# EAGLE design csp_v2.1 (EAGLE 7.6.0)
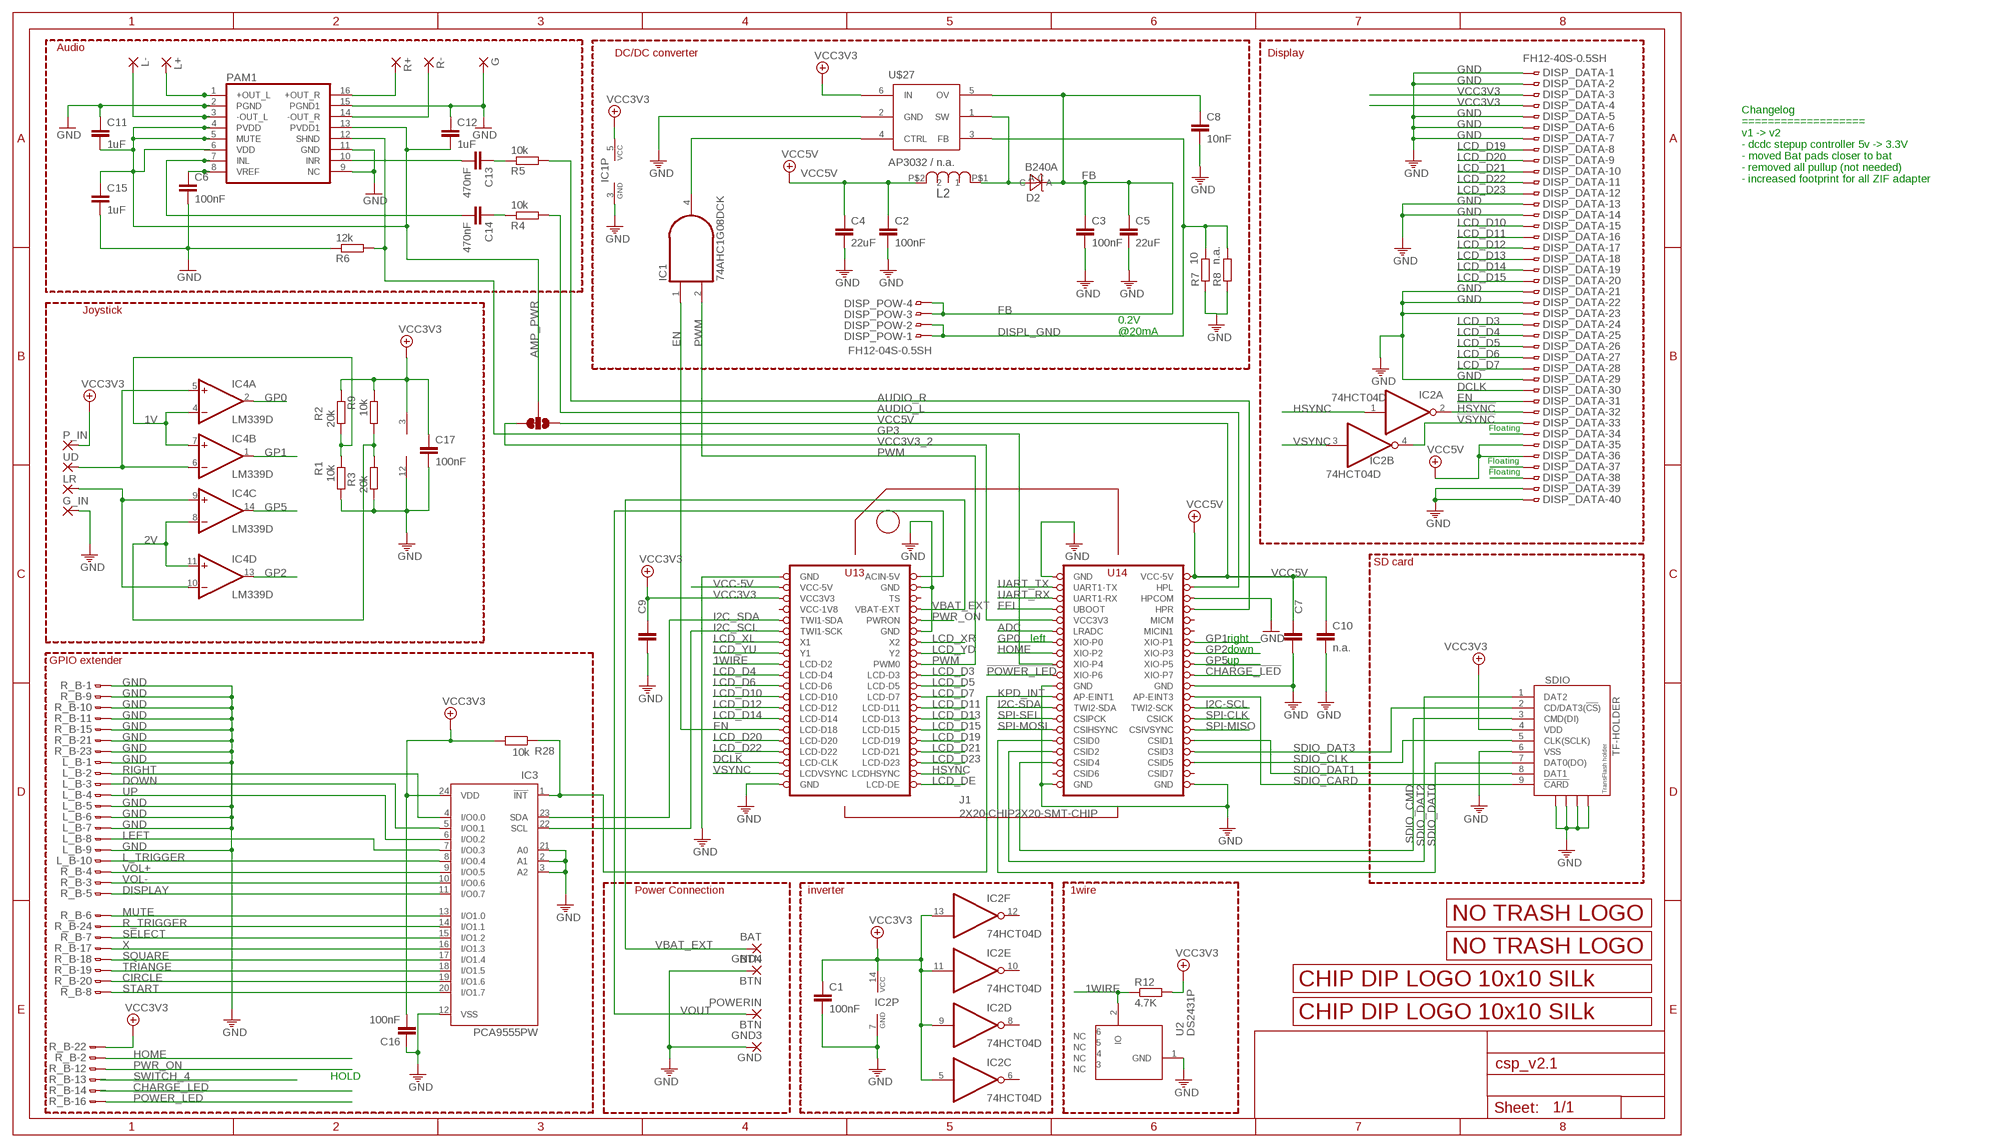
[diagram p0: schematic, sheet 1]

## Parts
BAT  BTN  SMD2  [SMD1,27-2,54]
C1  100nF  C-EUC0805  [C0805]
C2  100nF  C-EUC0805  [C0805]
C3  100nF  C-EUC0805  [C0805]
C4  22uF  C-EUC1206  [C1206]
C5  22uF  C-EUC1206  [C1206]
C6  100nF  C-EUC0805  [C0805]
C7  n.a.  C-EUC0805  [C0805]
C8  10nF  C-EUC0805  [C0805]
C9  n.a.  C-EUC0805  [C0805]
C10  n.a.  C-EUC0805  [C0805]
C11  1uF  C-EUC0805  [C0805]
C12  1uF  C-EUC0805  [C0805]
C13  470nF  C-EUC0805  [C0805]
C14  470nF  C-EUC0805  [C0805]
C15  1uF  C-EUC0805  [C0805]
C16  100nF  C-EUC0805  [C0805]
C17  100nF  C-EUC0805  [C0805]
D2  B240A  DIODE_SCHTKY_B240  [DO-214AC]
DISP_DATA  FH12-40S-0.5SH  [FH12-40S-0.5SH]
DISP_POW  FH12-04S-0.5SH  [FH12-04S-0.5SH]
G  1,6/0,8  [1,6/0,8]
G_IN  BTN  SMD1.36X3  [SMD1,36-3]
GND3  GND  SMD2  [SMD1,27-2,54]
GND4  BTN  SMD2  [SMD1,27-2,54]
IC1  74AHC1G08DCK  [SC70-5]
IC2  74HCT04D  [SO14]
IC3  PCA9555PW  [TSSOP24]
IC4  LM339D  [SO14]
J1  2X20-CHIP2X20-SMT-CHIP  [2XAWHW40_G_SMD_R]
L2  SRN6045-100M  [SRN6045]
L+  1,6/0,8  [1,6/0,8]
L-  1,6/0,8  [1,6/0,8]
L_B  FH12-10S-0.5SH  [FH12-10S-0.5SH]
LR  BTN  SMD1.36X3  [SMD1,36-3]
P_IN  BTN  SMD1.36X3  [SMD1,36-3]
PAM1  PAM8403  [SOP-16]
POWERIN  BTN  SMD2  [SMD1,27-2,54]
R1  10k  R-EU_M0805  [M0805]
R2  20k  R-EU_M0805  [M0805]
R3  20k  R-EU_M0805  [M0805]
R4  10k  R-EU_R0805  [R0805]
R5  10k  R-EU_R0805  [R0805]
R6  12k  R-EU_R0805  [R0805]
R7  10  R-EU_M0805  [M0805]
R8  n.a.  R-EU_M0805  [M0805]
R9  10k  R-EU_M0805  [M0805]
R12  4.7K  R-EU_M0805  [M0805]
R28  10k  R-EU_M0805  [M0805]
R+  1,6/0,8  [1,6/0,8]
R-  1,6/0,8  [1,6/0,8]
R_B  FH12-24S-0.5SH  [FH12-24S-0.5SH]
SDIO  TF-HOLDER  [TF-PULL]
SJ3  SMD_SJ_3WAY_CLOSED  [SMD_SJ_3WAY_CLOSED]
U2  DS2431P  [TSOC6]
U$2  LOGO_10X10_SILK  [LOGO2_10X10_SILK]
U$3  LOGO_NO_TRASHROHS  [LOGO_ROHS_SYM]
U$4  LOGO_NO_TRASHNO_TRASH  [LOGO_ROHS_NO_TRASH]
U$5  LOGO_10X10_SILK  [LOGO2_10X10_SILK]
U$27  AP3032 / n.a.  AP3032  [SOT23-6]
UD  BTN  SMD1.36X3  [SMD1,36-3]

## Nets
1V: IC4.4(A:-IN) IC4.7(B:+IN) R1.1 R2.2
1WIRE: J1.LCD-D2 R12.1 U2.2(IO)
2V: IC4.8(C:-IN) IC4.11(D:+IN) R3.1 R9.2
!CHARGE_LED: J1.XIO-P7 R_B.14
!HSYNC: DISP_DATA.32 IC2.2(A:O)
!POWER_LED: J1.XIO-P6 R_B.16
!VSYNC: DISP_DATA.33 IC2.4(B:O)
ADC: J1.LRADC
AMP_PWR: C11.2 C12.2 C15.1 PAM1.4(PVDD) PAM1.5(MUTE) PAM1.6(VDD) PAM1.13(PVDD1) SJ3.2
AUDIO_L: J1.HPL R4.2
AUDIO_R: J1.HPR R5.2
CIRCLE: IC3.19(I/O1.6) R_B.20
DCLK: DISP_DATA.30 J1.LCD-CLK
DISPL_GND: DISP_POW.1 DISP_POW.2 R7.2 R8.2 U$27.3(FB)
DISPLAY: IC3.11(I/O0.7) R_B.5
DOWN: IC3.5(I/O0.1) L_B.3
EN: DISP_DATA.31 IC1.1(I0) J1.LCD-D18
FB: C3.1 C5.1 C8.1 D2.C DISP_POW.3 DISP_POW.4 U$27.5(OV)
FEL: J1.FEL(UBOOT)
GND: C1.2 C2.2 C3.2 C4.2 C5.2 C6.2 C7.2 C8.2 C9.2 C10.2 C11.1 C12.1 C15.2 C16.1 C17.2 DISP_DATA.1 DISP_DATA.2 DISP_DATA.5 DISP_DATA.6 DISP_DATA.7 DISP_DATA.13 DISP_DATA.14 DISP_DATA.21 DISP_DATA.22 DISP_DATA.23 DISP_DATA.29 DISP_DATA.39 DISP_DATA.40 G.1(P) G_IN.P$1(P) GND3.1(P) GND4.1(P) IC1.3(GND) IC2.7(P:GND) IC3.2(A1) IC3.3(A2) IC3.12(VSS) IC3.21(A0) IC4.12(P:GND) J1.GND@1(GND) J1.GND@2(GND) J1.GND@3(GND) J1.GND@4(GND) J1.GND@5(GND) J1.GND@6(GND) J1.GND@7(GND) J1.GND@8(GND) J1.GND@10(GND) J1.HPCOM L_B.1 L_B.5 L_B.6 L_B.7 L_B.9 PAM1.2(PGND) PAM1.9(NC) PAM1.11(GND) PAM1.15(PGND1) R1.2 R3.2 R6.1 R7.1 R8.1 R_B.1 R_B.9 R_B.10 R_B.11 R_B.15 R_B.21 R_B.23 SDIO.6(VSS) SDIO.S1 SDIO.S2 SDIO.S3 SDIO.S4 U2.1(GND) U$27.2(GND)
GP0: IC4.2(A:OUT) J1.XIO-P0
GP1: IC4.1(B:OUT) J1.XIO-P1
GP2: IC4.13(D:OUT) J1.XIO-P3
GP3: J1.XIO-P4 PAM1.12(SHND) R6.2
GP5: IC4.14(C:OUT) J1.XIO-P5
HOME: J1.XIO-P2 R_B.2
HSYNC: IC2.1(A:I) J1.LCD-HSYNC(LCDHSYNC)
I2C-SCL: J1.TWI2-SCK
I2C-SDA: J1.TWI2-SDA
I2C_SCL: IC3.22(SCL) J1.TWI1-SCK
I2C_SDA: IC3.23(SDA) J1.TWI1-SDA
INL: C14.2 PAM1.7(INL)
INR: C13.2 PAM1.10(INR)
KPD_INT: IC3.1(!INT) J1.AP-EINT1 R28.1
L+OUT: L+.1(P) PAM1.1(+OUT_L)
L-OUT: L-.1(P) PAM1.3(-OUT_L)
L_TRIGGER: IC3.8(I/O0.4) L_B.10
LCD_D3: DISP_DATA.24 J1.LCD-D3
LCD_D4: DISP_DATA.25 J1.LCD-D4
LCD_D5: DISP_DATA.26 J1.LCD-D5
LCD_D6: DISP_DATA.27 J1.LCD-D6
LCD_D7: DISP_DATA.28 J1.LCD-D7
LCD_D10: DISP_DATA.15 J1.LCD-D10
LCD_D11: DISP_DATA.16 J1.LCD-D11
LCD_D12: DISP_DATA.17 J1.LCD-D12
LCD_D13: DISP_DATA.18 J1.LCD-D13
LCD_D14: DISP_DATA.19 J1.LCD-D14
LCD_D15: DISP_DATA.20 J1.LCD-D15
LCD_D19: DISP_DATA.8 J1.LCD-D19
LCD_D20: DISP_DATA.9 J1.LCD-D20
LCD_D21: DISP_DATA.10 J1.LCD-D21
LCD_D22: DISP_DATA.11 J1.LCD-D22
LCD_D23: DISP_DATA.12 J1.LCD-D23
LCD_DE: J1.LCD-DE
LCD_XL: J1.X1
LCD_XR: J1.X2
LCD_YD: J1.Y2
LCD_YU: J1.Y1
LEFT: IC3.7(I/O0.3) L_B.8
MUTE: IC3.13(I/O1.0) R_B.6
N$1: IC1.4(O) U$27.4(CTRL)
N$9: DISP_DATA.38
N$24: DISP_DATA.37
N$25: DISP_DATA.34
N$30: IC4.5(A:+IN) IC4.6(B:-IN) UD.P$1(P)
N$31: IC4.9(C:+IN) IC4.10(D:-IN) LR.P$1(P)
N$38: C6.1 PAM1.8(VREF)
N$41: C14.1 R4.1
N$43: C13.1 R5.1
PWM: IC1.2(I1) J1.PWM0
PWR_ON: J1.PWRON R_B.12
R+OUT: PAM1.16(+OUT_R) R+.1(P)
R-OUT: PAM1.14(-OUT_R) R-.1(P)
R_TRIGGER: IC3.14(I/O1.1) R_B.24
RIGHT: IC3.4(I/O0.0) L_B.2
SDIO_CARD: J1.AP-EINT3 SDIO.9(!CARD)
SDIO_CLK: J1.CSID5 SDIO.5(CLK(SCLK))
SDIO_CMD: J1.CISD4(CSID4) SDIO.3(CMD(DI))
SDIO_DAT0: J1.CSID0 SDIO.7(DAT0(DO))
SDIO_DAT1: J1.CSID1 SDIO.8(DAT1)
SDIO_DAT2: J1.CSID2 SDIO.1(DAT2)
SDIO_DAT3: J1.CSID3 SDIO.2(CD/DAT3(!CS!))
SELECT: IC3.15(I/O1.2) R_B.7
SPI-CLK: J1.CSICK
SPI-MISO: J1.CSIVSYNC
SPI-MOSI: J1.CSIHYSYNC(CSIHSYNC)
SPI-SEL: J1.CSPICK(CSIPCK)
SQUARE: IC3.17(I/O1.4) R_B.18
START: IC3.20(I/O1.7) R_B.8
SWITCH_4: R_B.13
TRIANGE: IC3.18(I/O1.5) R_B.19
UART_RX: J1.UART1-RX
UART_TX: J1.UART1-TX
UP: IC3.6(I/O0.2) L_B.4
VBAT_EXT: BAT.1(P) J1.BAT(VBAT-EXT)
VCC3V3: C1.1 C9.1 C16.2 C17.1 DISP_DATA.3 DISP_DATA.4 IC1.5(VCC) IC2.5(C:I) IC2.9(D:I) IC2.11(E:I) IC2.13(F:I) IC2.14(P:VCC) IC3.24(VDD) IC4.3(P:V+) J1.VCC3V3@2(VCC3V3) P_IN.P$1(P) R2.1 R9.1 R12.2 R28.2 R_B.22 SDIO.4(VDD) U$27.6(IN)
VCC3V3_2: J1.VCC3V3@1(VCC3V3) SJ3.1
VCC5V: C2.1 C4.1 C7.1 C10.1 DISP_DATA.35 DISP_DATA.36 J1.VCC-5V@2(VCC-5V) L2.P$2 SJ3.3
VCC-5V: J1.VCC-5V@1(VCC-5V)
VOL+: IC3.9(I/O0.5) R_B.4
VOL-: IC3.10(I/O0.6) R_B.3
VOUT: J1.CHG-IN(ACIN-5V) POWERIN.1(P)
VREG_OUTPUT: D2.A L2.P$1 U$27.1(SW)
VSYNC: IC2.3(B:I) J1.LCD-VSYNC(LCDVSYNC)
X: IC3.16(I/O1.3) R_B.17
Unconnected: IC2.6(C:O) IC2.8(D:O) IC2.10(E:O) IC2.12(F:O) J1.CSID6 J1.CSID7 J1.MICIN1 J1.MICM J1.TS U2.3(NC) U2.4(NC) U2.5(NC) U2.6(NC)

## Notes on the sheet
- Audio
- DC/DC converter | Display
- Changelog
  ===================
  v1 -> v2
  - dcdc stepup controller 5v -> 3.3V
  - moved Bat pads closer to bat
  - removed all pullup (not needed)
  - increased footprint for all ZIF adapter
- Joystick
- 0.2V
  @20mA
- Floating
- Floating
- Floating
- SD card
- left | right
- down
- GPIO extender | up
- Power Connection | inverter | 1wire
- HOLD

## Power pins joined to a net without a drawn wire
VCC-1V8: J1.VCC1V8(VCC-1V8)

## Library data of the parts
BAT GND3 GND4 POWERIN = wirepad:SMD2: SMD PAD
C1-C17 = rcl:C-EU: CAPACITOR, European symbol
D2 = Keyboard v0_5:DIODE_SCHTKY_B240; DESCRIPTION: DIODE SMD General Purpose 400V 1A 1.4W RoHS DO-214AC; FOOTPRINT: DO-214AC; LINK: http://www.digikey.com/product-detail/en/B240A-13-F/B240A-FDICT-ND/717810; MFG: DIGIKEY; MFG_PN: B240A-FDICT-ND; PART_TYPE: DIODE; PRICE: 0.11; VENDOR: DIODES; VENDOR_PART_NUMBER: B240A-13-F
DISP_DATA = JKW_CHIP:FH12-40S-0.5S: 0.5mm Pitch Connectors For FPC/FFC Source: Data sheet <http://www.hirose.co.jp/cataloge_hp/e58605370.pdf>; MPN: FH12-40S-0.5SH(55); OC_FARNELL: 1324556; OC_NEWARK: 34M6178
DISP_POW = JKW_CHIP:FH12-04S-0.5S: 0.5mm Pitch Connectors For FPC/FFC Source: Data sheet <http://www.hirose.co.jp/cataloge_hp/e58605370.pdf>; MPN: FH12-10S-0.5SH(55); OC_FARNELL: 1324540; OC_NEWARK: 34M6152
G L+ L- R+ R- = wirepad:1,6/0,8: THROUGH-HOLE PAD
G_IN LR P_IN UD = JKW_CHIP:SMD1.36X3: SMD PAD
IC1 = 74xx-little-us:74*1G08: 2-input AND gate
IC2 = JKW_CHIP:74*04: Hex INVERTER
IC3 = micro-philips:PCA9555: 16-bit I2C and SMBus I/O port with interrupt Source: PCA9555_5.pdf; MPN: PCA9555PW; OC_FARNELL: 1408297; OC_NEWARK: 63K6069
IC4 = linear:LM339: Low Power Low Offset Voltage Quad Comparators with open collector; LM139/LM239/LM339/LM2901/LM3302
J1 = JKW_CHIP:2X20-CHIP: Chip header
L2 = Keyboard v0_5:SRN6045-100M; DESCRIPTION: power inductor 10uH 2.5A 58.6 mohm; FOOTPRINT: SRN6045; LINK: http://www.digikey.com/product-detail/en/SRN6045-100M/SRN6045-100MTR-ND/2756120; MFG: DIGIKEY; MFG_PN: SRN6045-100MTR-ND; PART_TYPE: IND; PRICE: 0.15; TOLLERANCE: ±20%; VENDOR: BOURNS; VENDOR_PART_NUMBER: SRN6045-100M
L_B = JKW_CHIP:FH12-10S-0.5S: 0.5mm Pitch Connectors For FPC/FFC Source: Data sheet <http://www.hirose.co.jp/cataloge_hp/e58605370.pdf>; MPN: FH12-10S-0.5SH(55); OC_FARNELL: 1324540; OC_NEWARK: 34M6152
PAM1 = JKW_CHIP:PAM8403: Dual channel audio amplifier IC - PAM8403
R1-R9 R12 R28 = rcl:R-EU_: RESISTOR, European symbol
R_B = JKW_CHIP:FH12-24S-0.5S: 0.5mm Pitch Connectors For FPC/FFC Source: Data sheet <http://www.hirose.co.jp/cataloge_hp/e58605370.pdf>; MPN: FH12-24S-0.5SH(55); OC_FARNELL: 1324552; OC_NEWARK: 34M6170
SDIO = JKW_CHIP:TF-HOLDER: TF / Micro SD socket is PUSH-PUSH type, the card can be pushed into and auto locked and pushed out by simply press the card. Surface Mounting type.
SJ3 = JKW_CHIP:SMD_SJ_3WAY_CLOSED
U2 = JKW_CHIP:DS2431: 1024-Bit EEPROM This chip provides a 4x256 Bit EEPROM, which can be programmed@5V. Write protection and OTP emulation are available, too. Author: Jan Kandziora <jjj@gmx.de>; DESCRIPTION: IC, 1024-Bit, 1-Wire EEPROM, TSOC6; FOOTPRINT: TSOC6; LINK: http://www.digikey.com/product-detail/en/DS2431P%2BT%26R/DS2431P%2BT%26RCT-ND/3647900; MFG: DIGIKEY; MFG_PN: DS2431P+T&RCT-ND; PART_TYPE: IC; PRICE: 0.98; VENDOR: MAXIM; VENDOR_PART_NUMBER: DS2431P+T&R
U$2 U$5 = JKW_CHIP:LOGO_10X10_SILK
U$3 U$4 = JKW_CHIP:LOGO_NO_TRASH
U$27 = JKW_CHIP:AP3032

## Board
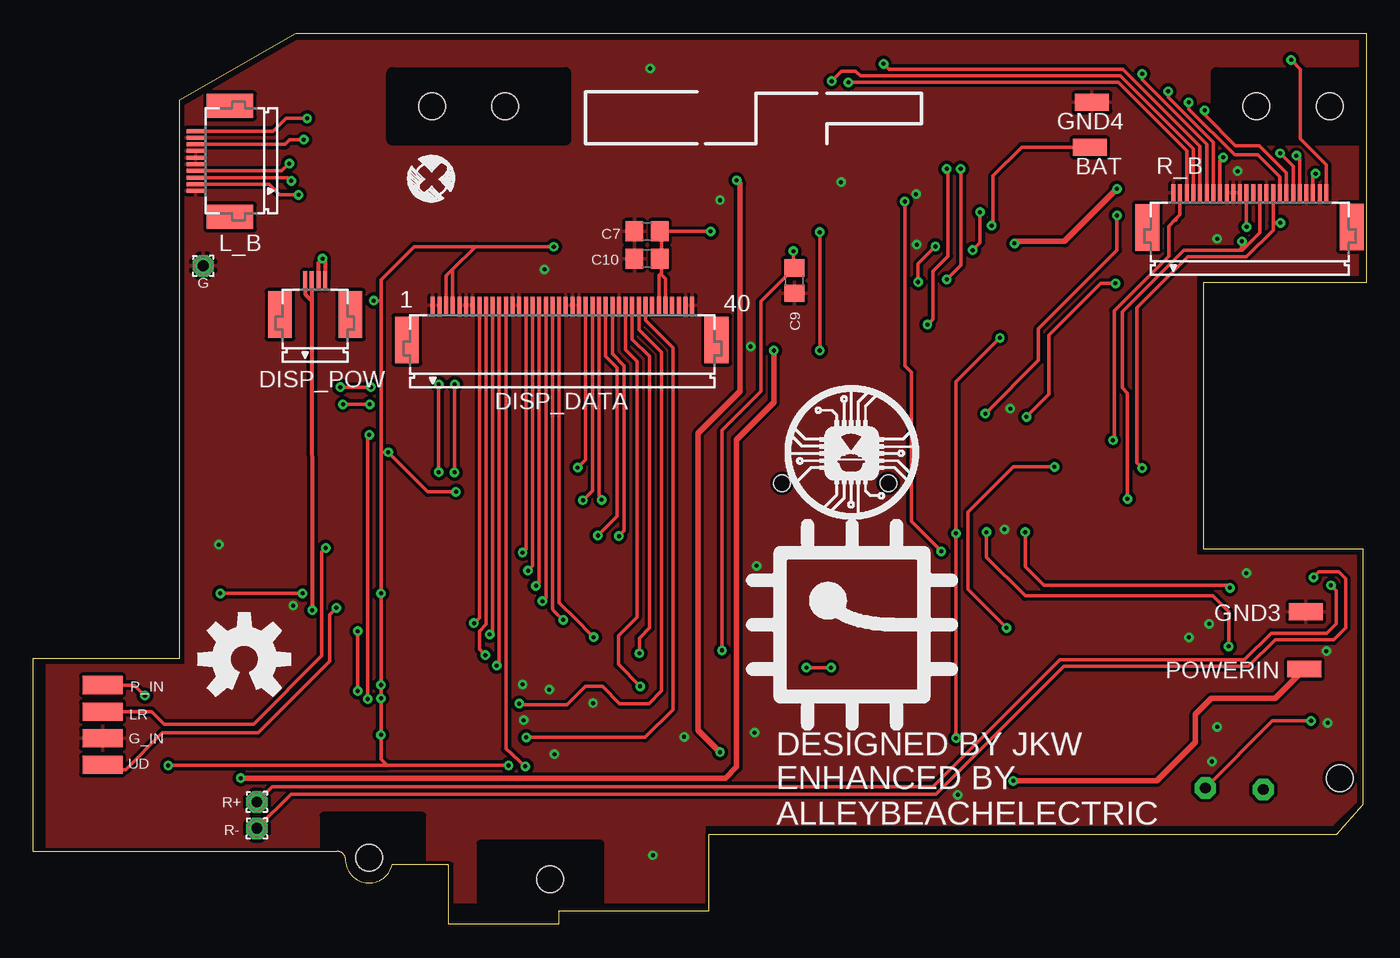
[diagram p1: board, top side]
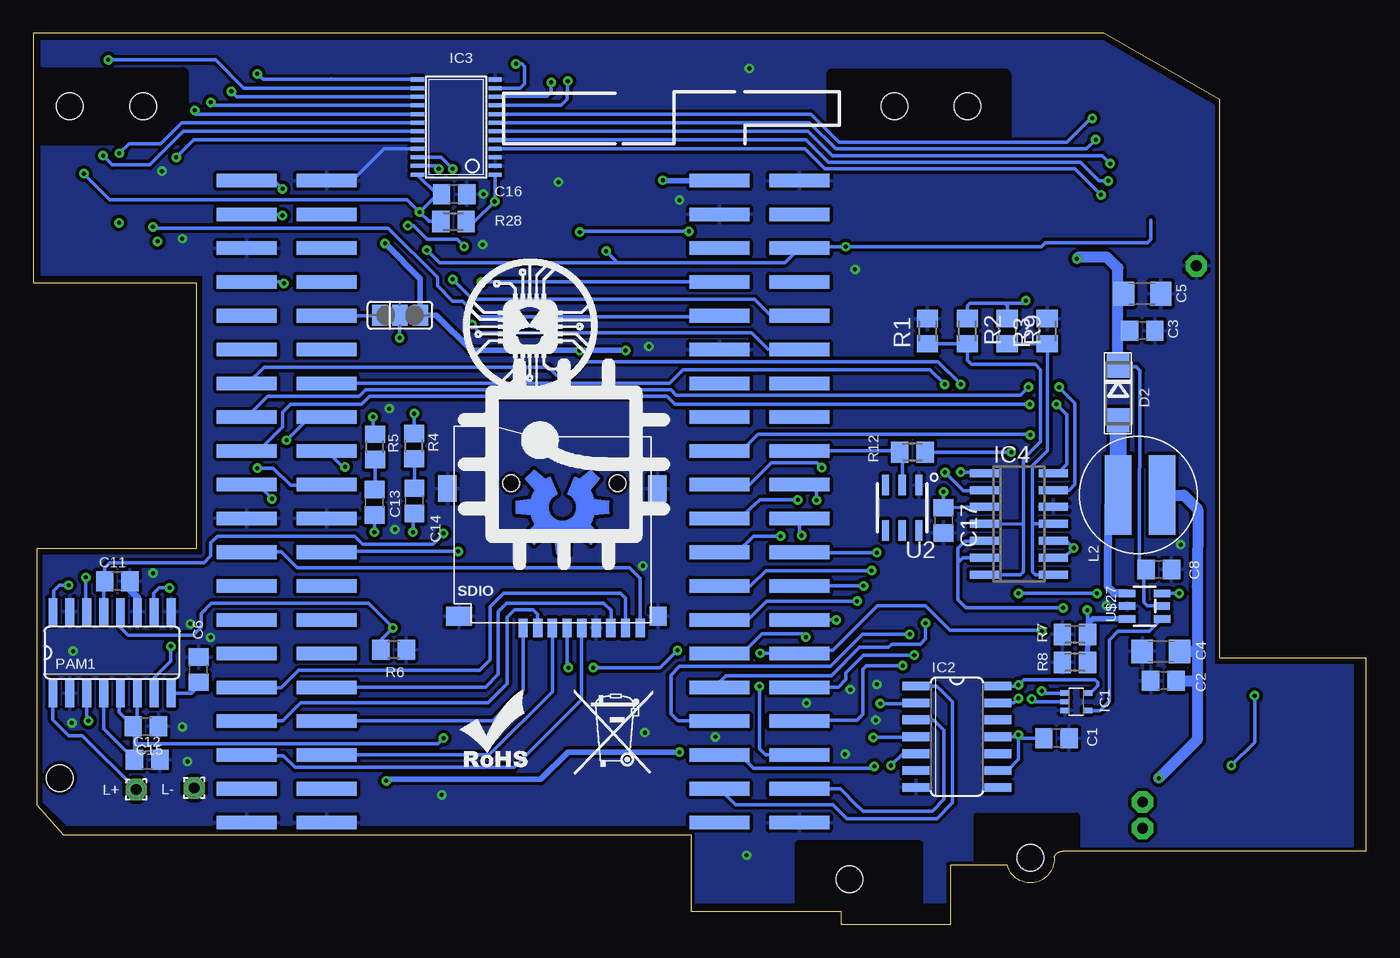
[diagram p2: board, bottom side, seen from below]

Size 100.25 x 67 mm. Coordinates in mm from the lower left corner, seen from the top.
Outline: 50.8,1 39.5,1 39.5,0 31.25,0 31.25,4.5 27,4.5 arc-170 23.48,5 arc80 22.85,5.5 0,5.5 0,20 11,20 11,62 19.75,67 100.25,67 100.25,48.25 88,48.25 88,28.25 100,28.25 100,9 98,6.75 50.8,6.75 50.8,1
Copper layers (1*2*15*16): Top 0.035mm / dielectric 0.2mm / Route2 0.035mm / dielectric 0.2mm / Route15 0.035mm / dielectric 0.2mm / Bottom 0.035mm
Design rules "NTC": minimum track width 7mil, minimum drill 10mil, track to track 8mil, track to pad 8mil, pad to pad 8mil, via to via 8mil, smd to smd 3mil, copper to edge 8mil, drill to drill 8mil, minimum pad ring 10mil, minimum via ring 8mil, stop-mask expansion 4mil, vias tented up to drill 0.3mm, thermal gap 10mil
Holes 2 mm at 38.88,3.39 25.25,5 30,61.5 97.5,61.5 92,61.5 35.5,61.5 98.25,11
bKeepout: area 25.4,3.2 to 31.6,65.1; area 94.5,7 to 100,14
tRestrict: area 27,59 to 40,64; area 89,59 to 99.6,64; area 33.6,1.3 to 42.7,6.1; area 21.8,2.9 to 29.3,8.2
bRestrict: area 27.1,58.9 to 40.1,63.9; area 89,59 to 99.6,64; area 21.8,2.8 to 29.3,8.2; area 33.6,1.3 to 42.7,6.1

### Footprints (pad centres in the part's own frame; a part is rotated, then mirrored left to right if it is on the bottom)
SMD1,27-2,54 = smd 1.27 x 2.54: 1 0,0
C0805 = smd 1.3 x 1.5: 1 -0.95,0; 2 0.95,0
C1206 = smd 1.6 x 1.8: 1 -1.4,0; 2 1.4,0
DO-214AC = smd 1.8 x 1.7: A 2.05,0; C -2.05,0
FH12-40S-0.5SH = smd 0.3 x 1.3: 1 -9.75,3.25; 2 -9.25,3.25; 3 -8.75,3.25; 4 -8.25,3.25; 5 -7.75,3.25; 6 -7.25,3.25; 7 -6.75,3.25; 8 -6.25,3.25; 9 -5.75,3.25; 10 -5.25,3.25; 11 -4.75,3.25; 12 -4.25,3.25; 13 -3.75,3.25; 14 -3.25,3.25; 15 -2.75,3.25; 16 -2.25,3.25; 17 -1.75,3.25; 18 -1.25,3.25; 19 -0.75,3.25; 20 -0.25,3.25; 21 0.25,3.25; 22 0.75,3.25; 23 1.25,3.25; 24 1.75,3.25; 25 2.25,3.25; 26 2.75,3.25; 27 3.25,3.25; 28 3.75,3.25; 29 4.25,3.25; 30 4.75,3.25; 31 5.25,3.25; 32 5.75,3.25; 33 6.25,3.25; 34 6.75,3.25; 35 7.25,3.25; 36 7.75,3.25; 37 8.25,3.25; 38 8.75,3.25; 39 9.25,3.25; 40 9.75,3.25 | smd 1.8 x 3.5: P$1 -11.7,0.65; P$2 11.6,0.65
FH12-04S-0.5SH = smd 0.3 x 1.3: 1 -0.75,3.25; 2 -0.25,3.25; 3 0.25,3.25; 4 0.75,3.25 | smd 1.8 x 3.5: P$1 -2.65,0.65; P$2 2.65,0.65
1,6/0,8 = drill 0.813 pad 1.6 octagon: 1 0,0
SMD1,36-3 = smd 1.36 x 3: P$1 0,0
SC70-5 = smd 0.4 x 0.7: 1 -0.65,-0.85; 2 0,-0.85; 3 0.65,-0.85; 4 0.65,0.85; 5 -0.65,0.85
SO14 = smd 0.66 x 2.032: 1 -3.81,-3.073; 2 -2.54,-3.073; 3 -1.27,-3.073; 4 0,-3.073; 5 1.27,-3.073; 6 2.54,-3.073; 7 3.81,-3.073; 8 3.81,3.073; 9 2.54,3.073; 10 1.27,3.073; 11 0,3.073; 12 -1.27,3.073; 13 -2.54,3.073; 14 -3.81,3.073
TSSOP24 = smd 0.305 x 0.991: 1 -3.575,-2.918; 2 -2.925,-2.918; 3 -2.275,-2.918; 4 -1.625,-2.918; 5 -0.975,-2.918; 6 -0.325,-2.918; 7 0.325,-2.918; 8 0.975,-2.918; 9 1.625,-2.918; 10 2.275,-2.918; 11 2.925,-2.918; 12 3.575,-2.918; 13 3.575,2.918; 14 2.925,2.918; 15 2.275,2.918; 16 1.625,2.918; 17 0.975,2.918; 18 0.325,2.918; 19 -0.325,2.918; 20 -0.975,2.918; 21 -1.625,2.918; 22 -2.275,2.918; 23 -2.925,2.918; 24 -3.575,2.918
SO14' = smd 0.6 x 2.2: 1 -3.81,-2.6; 2 -2.54,-2.6; 3 -1.27,-2.6; 4 0,-2.6; 5 1.27,-2.6; 6 2.54,-2.6; 7 3.81,-2.6; 8 3.81,2.6; 9 2.54,2.6; 10 1.27,2.6; 11 0,2.6; 12 -1.27,2.6; 13 -2.54,2.6; 14 -3.81,2.6
2XAWHW40_G_SMD_R = smd 4.5 x 1.02 bottom: AP-EINT1 35.1,21.59; AP-EINT3 41.1,21.59; BAT 5.54,41.91; CHG-IN 5.54,49.53; CISD4 35.1,6.35; CSICK 41.1,16.51; CSID0 35.1,11.43; CSID1 41.1,11.43; CSID2 35.1,8.89; CSID3 41.1,8.89; CSID5 41.1,6.35; CSID6 35.1,3.81; CSID7 41.1,3.81; CSIHYSYNC 35.1,13.97; CSIVSYNC 41.1,13.97; CSPICK 35.1,16.51; FEL 35.1,41.91; GND@1 -0.46,49.53; GND@2 5.54,46.99; GND@3 5.54,36.83; GND@4 -0.46,1.27; GND@5 41.1,1.27; GND@6 35.1,1.27; GND@7 41.1,24.13; GND@8 35.1,24.13; GND@10 35.1,49.53; HPCOM 41.1,44.45; HPL 41.1,46.99; HPR 41.1,41.91; LCD-CLK -0.46,6.35; LCD-D2 -0.46,29.21; LCD-D3 5.54,26.67; LCD-D4 -0.46,26.67; LCD-D5 5.54,24.13; LCD-D6 -0.46,24.13; LCD-D7 5.54,21.59; LCD-D10 -0.46,21.59; LCD-D11 5.54,19.05; LCD-D12 -0.46,19.05; LCD-D13 5.54,16.51; LCD-D14 -0.46,16.51; LCD-D15 5.54,13.97; LCD-D18 -0.46,13.97; LCD-D19 5.54,11.43; LCD-D20 -0.46,11.43; LCD-D21 5.54,8.89; LCD-D22 -0.46,8.89; LCD-D23 5.54,6.35; LCD-DE 5.54,1.27; LCD-HSYNC 5.54,3.81; LCD-VSYNC -0.46,3.81; LRADC 35.1,36.83; MICIN1 41.1,36.83; MICM 41.1,39.37; PWM0 5.54,29.21; PWRON 5.54,39.37; TS 5.54,44.45; TWI1-SCK -0.46,36.83; TWI1-SDA -0.46,39.37; TWI2-SCK 41.1,19.05; TWI2-SDA 35.1,19.05; UART1-RX 35.1,44.45; UART1-TX 35.1,46.99; VCC1V8 -0.46,41.91; VCC3V3@1 35.1,39.37; VCC3V3@2 -0.46,44.45; VCC-5V@1 -0.46,46.99; VCC-5V@2 41.1,49.53; X1 -0.46,34.29; X2 5.54,34.29; XIO-P0 35.1,34.29; XIO-P1 41.1,34.29; XIO-P2 35.1,31.75; XIO-P3 41.1,31.75; XIO-P4 35.1,29.21; XIO-P5 41.1,29.21; XIO-P6 35.1,26.67; XIO-P7 41.1,26.67; Y1 -0.46,31.75; Y2 5.54,31.75
SRN6045 = smd 2 x 6: P$1 1.5,0; P$2 -1.8,0
FH12-10S-0.5SH = smd 0.3 x 1.3: 1 -2.25,3.25; 2 -1.75,3.25; 3 -1.25,3.25; 4 -0.75,3.25; 5 -0.25,3.25; 6 0.25,3.25; 7 0.75,3.25; 8 1.25,3.25; 9 1.75,3.25; 10 2.25,3.25 | smd 1.8 x 3.5: P$1 -4.2,0.65; P$2 4.15,0.65
SOP-16 = smd 0.66 x 2.032: 1 -4.445,-3.073; 2 -3.175,-3.073; 3 -1.905,-3.073; 4 -0.635,-3.073; 5 0.635,-3.073; 6 1.905,-3.073; 7 3.175,-3.073; 8 4.445,-3.073; 9 4.445,3.073; 10 3.175,3.073; 11 1.905,3.073; 12 0.635,3.073; 13 -0.635,3.073; 14 -1.905,3.073; 15 -3.175,3.073; 16 -4.445,3.073
M0805 = smd 1.3 x 1.6: 1 -0.95,0; 2 0.95,0
R0805 = smd 1.3 x 1.5: 1 -0.95,0; 2 0.95,0
FH12-24S-0.5SH = smd 0.3 x 1.3: 1 -5.75,3.25; 2 -5.25,3.25; 3 -4.75,3.25; 4 -4.25,3.25; 5 -3.75,3.25; 6 -3.25,3.25; 7 -2.75,3.25; 8 -2.25,3.25; 9 -1.75,3.25; 10 -1.25,3.25; 11 -0.75,3.25; 12 -0.25,3.25; 13 0.25,3.25; 14 0.75,3.25; 15 1.25,3.25; 16 1.75,3.25; 17 2.25,3.25; 18 2.75,3.25; 19 3.25,3.25; 20 3.75,3.25; 21 4.25,3.25; 22 4.75,3.25; 23 5.25,3.25; 24 5.75,3.25 | smd 1.8 x 3.5: P$1 -7.7,0.65; P$2 7.65,0.7
TF-PULL = smd 0.7 x 1.4: 1 -2.2,-7.62; 2 -1.1,-7.62; 3 0,-7.62; 4 1.1,-7.62; 5 2.2,-7.62; 6 3.3,-7.62; 7 4.4,-7.62; 8 5.5,-7.62; 9 6.6,-7.62 | smd 1.4 x 2: S1 -7.9,2.85; S2 7.9,2.85 | smd 1.28 x 1.4: S3 7.96,-6.75 | smd 1.95 x 1.4: S4 -7.025,-6.75 | hole 1.25: -3.1,3.25; 4.9,3.25
SMD_SJ_3WAY_CLOSED = smd 1.168 x 1.6: 1 -1.524,0; 2 0,0; 3 1.524,0
TSOC6 = smd 0.53 x 1.53: 1 -1.27,-1.7; 2 0,-1.7; 3 1.27,-1.7; 4 1.27,1.7; 5 0,1.7; 6 -1.27,1.7
SOT23-6 = smd 0.559 x 1.219: 1 -0.95,-1.3; 2 0,-1.3; 3 0.965,-1.3; 4 0.965,1.321; 5 0,1.3; 6 -0.95,1.321

### Placement (x,y rotation side)
BAT  79.47,58.43 90 top
C1  23.3,14 0 bottom
C2  15.26,18.32 180 bottom
C3  16.85,44.65 0 bottom
C4  15.45,20.52 180 bottom
C5  16.85,47.43 0 bottom
C6  87.82,19.15 90 bottom
C7  46.16,52.11 180 top
C8  15.6,26.68 0 bottom
C9  57.24,48.4 270 top
C10  46.16,50.05 180 top
C11  93.93,25.81 180 bottom
C12  91.68,12.37 180 bottom
C13  74.58,31.74 270 bottom
C14  71.59,31.84 270 bottom
C15  91.78,14.89 0 bottom
C16  68.6,54.9 180 bottom
C17  31.79,30.38 270 bottom
D2  18.68,39.95 270 bottom
DISP_DATA  39.8,43.3 0 top
DISP_POW  21.2,45.2 0 top
G  12.78,49.51 0 top
G_IN  5.22,14 90 top
GND3  95.7,23.5 90 top
GND4  79.62,61.81 90 top
IC1  21.81,16.74 270 bottom
IC2  30.79,14.11 270 bottom
IC3  68.45,59.95 90 bottom
IC4  LM339D  [SO14']  26.12,30.11 270 bottom
J1  43.1,6.39 0 top
L2  17.15,32.28 180 bottom
L+  92.51,10.15 0 bottom
L-  88.15,10.25 0 bottom
L_B  15.45,57.4 90 top
LR  5.22,16 90 top
P_IN  5.22,18 90 top
PAM1  94.33,20.44 0 bottom
POWERIN  95.6,19.2 90 top
R1  33,44.6 90 bottom
R2  30,44.6 270 bottom
R3  24,44.6 90 bottom
R4  71.62,35.96 90 bottom
R5  74.56,35.91 90 bottom
R6  73.15,20.65 180 bottom
R7  21.9,21.8 0 bottom
R8  21.9,19.7 0 bottom
R9  27,44.6 270 bottom
R12  34.13,35.5 0 bottom
R28  68.65,52.85 180 bottom
R+  16.82,9.21 0 top
R-  16.82,7.22 0 top
R_B  91.5,51.75 0 top
SDIO  61.21,29.92 0 bottom
SJ3  72.67,45.8 0 bottom
U2  34.9,31.33 180 bottom
U$2  56.54,30.46 0 top
U$3  68.63,11.76 0 bottom
U$4  59.62,11.27 0 bottom
U$5  67.89,39.98 0 bottom
U$26  [CPC1-3]  49.78,10.16 0 top
U$27  16.68,23.94 270 bottom
U$28  [CPC1-3]  72.14,22.23 0 bottom
U$38  [FKIT-LOGO_SMALL]  29.97,56.01 0 top
U$39  [OSHW-LOGO-L_COPPER]  60.45,31.37 180 bottom
U$40  [OSHW-LOGO-L]  15.88,19.94 0 top
UD  5.22,12 90 top

### Tracks (layer width: path | path; a pad name or v marks a point on that pad's centre or on a via)
1V
  Bottom 0.254: R2.2 R1.1 30.05,43.65 30,43.6 30,42.4 29.7,42.1 24.9,42.1 24.5,41.7 24.5,36.3 25.8,35 25.8,30.1 | 25.8,30.1 25.8,26.5 26,26.3 IC4.7 | IC4.4 25.8,30.1
1WIRE
  Bottom 0.254: J1.LCD-D2 35.75,35.6 35.2,35.05 | 35.2,35.05 34.9,34.75 34.9,33.53 U2.2 | R12.1 35.08,35.17 35.2,35.05
2V
  Bottom 0.254: 25.1,30.1 25.1,34.5 24,35.6 R3.1 R9.2 | 25.1,30.1 25.1,26.5 24.9,26.3 IC4.8 | IC4.11 25.09,30.11 25.1,30.1
!CHARGE_LED  (via drill 0.3)
  Top 0.254: R_B.14 92.25,52 90.95,50.7 90.7,50.7 | 90.7,50.7 86.55,50.7 81.9,46.05 81.9,40.35 82.3,39.95 v82.3,32 | v90.9,51.35 90.9,50.9 90.7,50.7
  Bottom 0.254: J1.XIO-P7 84.11,33.15 83.45,33.15 83.55,33.05 83.35,33.05 v82.3,32 | 90.95,51.4 v90.9,51.35
!HSYNC  (via drill 0.3)
  Top 0.254: DISP_DATA.32 45.55,44.7 47.25,43 47.25,17.55 46.3,16.6 44.11,16.6 42.8,17.91 41.53,17.91 40.13,16.51 36.64,16.51 v36.55,16.6
  Bottom 0.254: v36.55,16.6 33.91,16.6 IC2.2
!POWER_LED  (via drill 0.3)
  Top 0.254: R_B.16 93.25,52.75 | 93.25,52.75 93.25,52.2 91.25,50.2 86.85,50.2 83,46.35 83,34.7 v83.4,34.3 | v93.8,52.75 93.25,52.75
  Bottom 0.254: v83.4,34.3 82.2,34.3 80.9,33 78.26,33
  Bottom 0.406: 78.26,33 78.2,33 J1.XIO-P6
!VSYNC  (via drill 0.3)
  Top 0.254: v37.07,14.06 46.01,14.06 48.1,16.15 48.1,43.36 46.05,45.41 DISP_DATA.33
  Bottom 0.254: v37.07,14.06 33.91,14.06 IC2.4
AMP_PWR  (via drill 0.3)
  Top 0.254: v72.7,44.1 69.4,40.8 v69.4,29.4 v69.4,14
  Bottom 0.254: C15.1 92.42,15.2 PAM1.6 | PAM1.5 93.8,17.25 93.8,15.96 C15.1 | PAM1.13 94.96,25.73 C11.2 94.88,26.82 94.5,27.2 87.4,27.2 86.9,27.7 86.9,28.7 86.4,29.2 76.1,29.2 75.5,28.6 70.2,28.6 v69.4,29.4 | v72.7,44.1 72.7,45.77 SJ3.2 | 69.7,13.7 v69.4,14 69.8,13.6 92.5,13.6 92.5,14.66 C15.1 | C15.1 92.63,14.79 C12.2 94.96,14.7 PAM1.4
AUDIO_L  (via drill 0.3)
  Top 0.254: v71.6,38.4 75.6,42.4 75.6,44.8 81.5,50.7 v81.5,53.3
  Bottom 0.254: R4.2 71.6,36.93 v71.6,38.4 | v81.5,53.3 81.58,53.38 J1.HPL
AUDIO_R  (via drill 0.3)
  Top 0.254: v74.7,38.15 76.4,39.85 76.4,44.3 80.3,48.2 v81.4,48.2
  Bottom 0.254: R5.2 74.7,37 v74.7,38.15 | v81.4,48.2 81.5,48.3 J1.HPR
CIRCLE  (via drill 0.3)
  Top 0.254: v95,57.8 95.25,57.55 R_B.20
  Bottom 0.254: IC3.19 88.97,59.62 91.5,57.1 94.3,57.1 v95,57.8
DCLK  (via drill 0.3)
  Top 0.254: v45.65,17.9 44,19.55 44,21.7 45.4,23.1 45.4,42.35 44.55,43.2 DISP_DATA.30
  Bottom 0.254: v45.65,17.9 45.65,13.2 45.2,12.75 J1.LCD-CLK
DISPL_GND  (via drill 0.3)
  Top 0.305: DISP_POW.2 20.95,46.89 | 20.95,46.89 v20.99,23.63 | DISP_POW.1 20.45,47.39 20.95,46.89
  Bottom 0.305: v20.99,23.63 20.99,21.64 R7.2
  Bottom 0.406: U$27.3 20.54,22.98 20.91,22.61 20.91,21.71 R7.2 20.98,19.79 R8.2
DISPLAY  (via drill 0.3)
  Top 0.254: R_B.5 87.75,58.5 81.95,64.3 64.35,64.3 v63.95,64.7
  Bottom 0.254: v63.95,64.7 63.5,64.7 63.3,64.5 63.3,63.2 63.62,62.88 IC3.11
DOWN  (via drill 0.3)
  Top 0.254: L_B.3 19.15,56.15 v19.4,55.9
  Bottom 0.254: v19.4,55.9 20.1,55.9 21.5,57.3 40.45,57.3 42.12,58.98 IC3.5
EN  (via drill 0.3)
  Top 0.254: v24.4,17.55 v24.4,22.05 | DISP_DATA.31 45.05,44 46.35,42.7 46.35,22.3 45.58,21.53 v45.58,20.39
  Bottom 0.254: IC1.1 24.24,17.39 v24.4,17.55 | v24.4,22.05 24.45,22.1 31.3,22.1 33.15,23.95 36.75,23.95 40.1,20.6 42.4,20.6 J1.LCD-D18 44.41,20.36 44.44,20.39 v45.58,20.39
FB  (via drill 0.3)
  Top 0.305: DISP_POW.4 21.95,49.86 v21.76,50.05 21.45,49.74 DISP_POW.3
  Bottom 0.254: U$27.5 16.45,23.94 16.73,24.22 16.73,26.59 17.05,26.91 17.01,41.64 17.3,41.93 18.61,41.93 D2.C | C5.1 18.66,47.43 18.68,47.45 | C3.1 17.8,44.75 18.68,44.75
  Bottom 0.813: D2.C 18.68,44.75 18.68,47.45 18.68,49.34 19.51,50.17 21.64,50.17 v21.76,50.05 | C8.1 16.64,26.59 16.73,26.59
GND  (via drill 0.3)
  Bottom 0.254: IC3.21 73.88,58.33 76.28,55.92 J1.GND@10
  Bottom 0.508: PAM1.11 92.42,24.6 92.96,25.15 92.96,25.8 C11.1
  other vias: 51.65,54.45 38.45,49.25 73.48,38.77 73.05,29.7 54.4,26.95 69.53,9.73 88.65,12.25 91.24,26.4 39.2,12.8 36.8,18.05 38.8,17.65 19.55,23.97 13.95,28.55 89.05,51.55 60.75,55.8 66.46,51.1 66.4,54.9 46.4,64.35 36.89,15.37 48.95,14.1 54.25,14.42 46.6,5.2 53.95,43.45 97.25,20.55 89.05,14.85 97.35,15.15 90.57,56.63 86.92,21.58 88.45,22.59 42.1,16.63
  pour Bottom (isolate 0.254): 11.45,61.55 19.8,66.4 99.6,66.4 99.6,48.85 87.45,48.85 87.45,27.7 99.45,27.7 99.45,9.2 97.75,7.5 50.5,7.5 50.5,1.65 31.7,1.65 31.7,4.75 24.15,4.75 24.15,5.85 1,5.85 1,19.5 11.45,19.5
  pour Top (isolate 0.254): 11.45,61.55 19.8,66.4 99.6,66.4 99.6,48.85 87.45,48.85 87.45,27.7 99.45,27.7 99.45,9.2 97.75,7.5 50.5,7.5 50.5,1.65 31.7,1.65 31.7,4.75 24.15,4.75 24.15,5.85 1,5.85 1,19.5 11.45,19.5
GP0  (via drill 0.3)
  Top 0.254: v31.7,40.6 31.7,34 v31.68,33.98
  Bottom 0.254: J1.XIO-P0 52.42,40.68 51.4,41.7 32.8,41.7 v31.7,40.6 | v31.68,33.98 30.3,32.6 29.3,32.6 29.25,32.66 IC4.2
GP1  (via drill 0.3)
  Top 0.254: v30.5,40.6 v30.5,34
  Bottom 0.254: J1.XIO-P1 84.12,40.68 82.9,41.9 61.5,41.9 60.9,41.3 59.8,41.3 58.8,42.3 32.2,42.3 v30.5,40.6 | v30.5,34 28.8,34 IC4.1
GP2  (via drill 0.3)
  Top 0.254: v23.1,40.4 v25.4,40.4
  Bottom 0.254: J1.XIO-P3 82.64,39.7 75.75,39.7 75.25,40.2 52.3,40.2 51.9,39.8 26,39.8 v25.4,40.4 | IC4.13 22.34,32.66 21.9,33.1 21.9,39.2 v23.1,40.4
GP3  (via drill 0.3)
  Top 0.254: v76.8,34.4 73.7,34.4 70.3,31 70.3,25.2 v73.2,22.3
  Bottom 0.254: J1.XIO-P4 77,34.4 v76.8,34.4 | PAM1.12 93.7,22.35 93.11,21.76 88.22,21.76 87.63,22.35 87.63,23.37 86.87,24.13 75.03,24.13 v73.2,22.3 74.1,21.4 R6.2
GP5  (via drill 0.3)
  Top 0.254: v25.3,39.1 v23.3,39.1
  Bottom 0.254: J1.XIO-P5 83.3,35.6 81.5,37.4 81.5,38.5 80.9,39.1 75.55,39.1 74.95,39.7 52.6,39.7 52,39.1 v25.3,39.1 | v23.3,39.1 22.5,38.3 22.5,34.6 23.18,33.92 IC4.14
HOME  (via drill 0.3)
  Top 0.254: R_B.2 86.25,53.35 85.9,53 | 85.9,53 85.4,52.5 85.4,50.25 81.3,46.15 81.3,36.5 v81.2,36.4 | 85.95,52.95 85.9,53
  Bottom 0.254: 79.95,38.15 J1.XIO-P2 79.46,38.14 v81.2,36.4
HSYNC
  Bottom 0.254: IC2.1 32.3,17.92 31.11,16.73 31.11,9.14 32.31,7.95 39.05,7.95 40.1,9 47.44,9 J1.LCD-HSYNC
I2C_SCL  (via drill 0.3)
  Top 0.254: v67.25,45.1 67.65,45.5 67.65,49.1 68.8,50.25 68.8,56.7 v68.7,56.8
  Bottom 0.254: v67.25,45.1 66.65,44.5 46.25,44.5 45,43.25 42.67,43.25 J1.TWI1-SCK | IC3.22 69.58,57.67 v68.7,56.8
I2C_SDA  (via drill 0.3)
  Top 0.254: v69.75,56.8 69.75,49.55 v68.7,48.5
  Bottom 0.254: IC3.23 69.97,57.02 v69.75,56.8 | v68.7,48.5 67.2,47 46,47 44.76,45.76 J1.TWI1-SDA
INL  (via drill 0.3)
  Top 0.254: v89.9,20.9 89.9,23.5 88.7,24.7 74.6,24.7 71.7,27.6 v71.7,29.5
  Bottom 0.254: C14.2 71.7,30.78 v71.7,29.5 | PAM1.7 91.15,18.55 89.9,19.8 v89.9,20.9
INR  (via drill 0.3)
  Top 0.254: v90,25.3 89.8,25.5 76,25.5 74.6,26.9 v74.6,29.5
  Bottom 0.254: C13.2 74.58,29.52 v74.6,29.5 | v90,25.3 90.8,25.3 91.2,24.9 91.2,23.56 PAM1.10
KPD_INT  (via drill 0.3)
  Top 0.254: v65.55,54.35 65.55,42 66.05,41.5 66.05,30.3 v68.3,28.05
  Bottom 0.254: IC3.1 65.53,54.37 v65.55,54.35 67.05,52.85 R28.1 | v68.3,28.05 78.13,28.05 J1.AP-EINT1
L+OUT
  Bottom 0.254: L+.1 96.56,14.2 97.6,14.2 98.77,15.37 PAM1.1
L-OUT  (via drill 0.3)
  Top 0.254: v96.1,15.3 93.2,15.3 L-.1
  Bottom 0.254: PAM1.3 96.23,15.43 v96.1,15.3
L_TRIGGER  (via drill 0.3)
  Top 0.254: L_B.10 18.05,59.65 19,60.6 v20.6,60.6
  Bottom 0.254: IC3.8 41.77,60.92 39.65,58.8 22.53,58.8 20.73,60.6 v20.6,60.6
LCD_D3  (via drill 0.3)
  Top 0.254: DISP_DATA.24 41.55,34.95 v40.95,34.35
  Bottom 0.254: v40.95,34.35 41.3,34.7 44.75,34.7 46.4,33.05 48.63,33.05 J1.LCD-D3
LCD_D4  (via drill 0.3)
  Top 0.254: DISP_DATA.25 42.05,32.6 v41.34,31.89
  Bottom 0.254: J1.LCD-D4 42.63,33.05 42,33.05 41.85,33.2 41.34,32.69 v41.34,31.89
LCD_D5  (via drill 0.3)
  Top 0.254: DISP_DATA.26 42.55,32.25 v42.75,31.92
  Bottom 0.254: v42.75,31.92 45.6,31.92 47.13,30.52 J1.LCD-D5
LCD_D6  (via drill 0.3)
  Top 0.254: DISP_DATA.27 43.05,42.7 43.9,41.85 43.9,30.68 v42.46,29.24
  Bottom 0.254: 42.64,30.69 J1.LCD-D6 42.64,29.42 v42.46,29.24
LCD_D7  (via drill 0.3)
  Top 0.254: v44.05,29.2 44.45,29.6 44.45,42 43.55,42.9 DISP_DATA.28
  Bottom 0.254: v44.05,29.2 46.1,29.2 47.32,27.98 J1.LCD-D7
LCD_D10  (via drill 0.3)
  Top 0.254: DISP_DATA.15 37.05,28.2 v36.8,27.95
  Bottom 0.254: v36.8,27.95 42.61,27.95 J1.LCD-D10
LCD_D11  (via drill 0.3)
  Top 0.254: DISP_DATA.16 37.55,26.95 v37.2,26.6
  Bottom 0.254: v37.2,26.6 45.15,26.6 46.3,25.45 J1.LCD-D11
LCD_D12  (via drill 0.3)
  Top 0.254: DISP_DATA.17 38.05,25.7 v37.8,25.45
  Bottom 0.254: v37.8,25.45 J1.LCD-D12
LCD_D13  (via drill 0.3)
  Top 0.254: DISP_DATA.18 38.55,24.55 v38.3,24.3
  Bottom 0.254: v38.3,24.3 45.1,24.3 46.5,22.9 J1.LCD-D13
LCD_D14  (via drill 0.3)
  Top 0.254: v39.85,22.9 39.23,23.52 39.05,23.7 DISP_DATA.19
  Bottom 0.254: v39.85,22.9 J1.LCD-D14
LCD_D15  (via drill 0.3)
  Top 0.254: v42.15,21.6 40.62,23.12 39.75,24 39.55,24.2 DISP_DATA.20
  Bottom 0.254: v42.15,21.6 42.4,21.85 45.45,21.85 46.94,20.36 J1.LCD-D15
LCD_D19  (via drill 0.3)
  Top 0.254: DISP_DATA.8 33.55,23.05 v33.15,22.65
  Bottom 0.254: J1.LCD-D19 48.64,18.21 48.15,18.7 40.23,18.7 38.1,20.83 35.94,20.83 35.69,21.08 33.53,21.08 33.15,21.46 v33.15,22.65
LCD_D20  (via drill 0.3)
  Top 0.254: v34,20.25 33.55,20.7 33.55,22.05 34.05,22.55 DISP_DATA.9
  Bottom 0.254: v34,20.25 37.8,20.25 39.12,18.93 39.12,18.41 39.71,17.82 J1.LCD-D20
LCD_D21  (via drill 0.3)
  Top 0.254: DISP_DATA.10 34.55,21.9 v34.32,21.8
  Bottom 0.254: J1.LCD-D21 48.66,15.3 51.75,15.3 52.3,15.85 52.3,18.75 51.65,19.4 40.29,19.4 37.89,21.8 v34.32,21.8
LCD_D22  (via drill 0.3)
  Top 0.254: DISP_DATA.11 35.05,19.65 v34.85,19.45
  Bottom 0.254: v34.85,19.45 37.6,19.45 37.85,19.2 37.85,15.8 38.3,15.35 42.57,15.35 J1.LCD-D22
LCD_D23  (via drill 0.3)
  Top 0.254: v37,11.88 35.55,13.2 DISP_DATA.12
  Bottom 0.254: J1.LCD-D23 47.1,12.75 46.1,11.75 37.13,11.75 v37,11.88
LEFT  (via drill 0.3)
  Top 0.254: L_B.8 18.95,58.65 19.3,59 v20.35,59
  Bottom 0.254: v20.35,59 21.05,58.3 39.9,58.3 41.88,60.27 IC3.7
MUTE  (via drill 0.3)
  Top 0.254: R_B.6 88.25,58.65 83.4,63.5 v83.4,63.95
  Bottom 0.254: v83.4,63.95 82.97,63.52 77.85,63.52 | 77.85,63.52 IC3.13 | 77.8,63.58 77.85,63.52
N$1
  Bottom 0.254: U$27.4 16.31,22.03 18.67,22.03 19.32,21.38 19.32,16.79 20.03,16.08 IC1.4
N$30  (via drill 0.3)
  Top 0.254: UD.P$1 4.85,11.64 | 4.85,11.64 4.62,11.43 | v22.8,23.8 22.3,23.3 22.3,19.8 16.9,14.4 9.7,14.4 6.94,11.64 4.85,11.64
  Bottom 0.254: v22.8,23.8 30.1,23.8 30.7,24.4 30.7,27.2 | 30.7,27.2 30.7,28.3 30.2,28.8 28.77,28.8 IC4.5 | IC4.6 30.32,27.57 30.7,27.2
N$31  (via drill 0.3)
  Top 0.254: v22,28.3 21.7,28 21.7,20.2 16.57,15.07 9.83,15.07 8.9,16 LR.P$1
  Bottom 0.254: IC4.10 22.55,28.84 v22,28.3 22.73,27.57 IC4.9
N$38
  Bottom 0.254: PAM1.8 88.34,17.36 87.82,17.88 C6.1
N$41
  Bottom 0.254: R4.1 71.59,34.98 C14.1
N$43
  Bottom 0.254: R5.1 74.56,32.72 C13.1
PWM  (via drill 0.3)
  Top 0.254: v25.15,16.95 25.15,36.67 v25.28,36.8
  Bottom 0.254: IC1.2 24.94,16.74 v25.15,16.95 | J1.PWM0 48.59,35.65 46.95,35.65 45.75,36.85 25.2,36.85 v25.28,36.8
PWR_ON  (via drill 0.3)
  Top 0.254: R_B.12 v91.25,52.45
  Bottom 0.254: J1.PWRON 48.7,45.7 66.8,45.7 67.96,46.86 68.71,46.86 69.85,48.01 69.85,48.64 73.55,52.34 85.45,52.34 85.47,52.32 91.12,52.32 v91.25,52.45
R+OUT  (via drill 0.3)
  Top 0.254: R+.1 17.96,10.35 67.65,10.35 77.2,19.9 91.1,19.9 93.1,21.9 97.3,21.9 98,22.6 98,25.1 v97.6,25.5
  Bottom 0.254: v97.6,25.5 98.3,25.5 98.7,25.1 98.7,23.58 PAM1.16
R-OUT  (via drill 0.3)
  Top 0.254: R-.1 19.4,9.8 67.9,9.8 77.5,19.4 91.4,19.4 93.4,21.4 97.8,21.4 98.7,22.3 98.7,26 98.2,26.5 96.7,26.5 v96.3,26.1
  Bottom 0.254: v96.3,26.1 96.3,23.58 PAM1.14
R_TRIGGER  (via drill 0.3)
  Top 0.254: v94.6,65 95.3,64.3 95.3,59.05 97.25,57.1 R_B.24
  Bottom 0.254: IC3.14 84.42,62.88 86.55,65 v94.6,65
RIGHT  (via drill 0.3)
  Top 0.254: v19.95,54.85 18.55,54.85 17.75,55.65 L_B.2
  Bottom 0.254: IC3.4 42.23,58.33 40.7,56.8 21.9,56.8 v19.95,54.85
SDIO_CARD
  Bottom 0.254: J1.AP-EINT3 84.18,28 81.6,28 80.4,26.8 55.4,26.8 54.61,26.01 SDIO.9
SDIO_CLK
  Bottom 0.254: J1.CSID5 84.16,12.7 81.45,12.7 80.55,11.8 64.1,11.8 59.01,16.89 SDIO.5
SDIO_CMD
  Bottom 0.254: J1.CISD4 65.96,12.74 61.21,17.49 SDIO.3
SDIO_DAT0
  Bottom 0.254: J1.CSID0 78.17,17.85 66.25,17.85 65.3,18.8 65.3,23.5 64.65,24.15 57.35,24.15 56.81,23.61 SDIO.7
SDIO_DAT1
  Bottom 0.254: J1.CSID1 84.18,17.8 81.6,17.8 80.3,19.1 66.7,19.1 65.9,19.9 65.9,23.9 64.9,24.9 56.1,24.9 55.71,24.51 SDIO.8
SDIO_DAT2
  Bottom 0.254: J1.CSID2 78.12,15.2 77.45,15.2 77.35,15.3 65.7,15.3 63.41,17.59 SDIO.1
SDIO_DAT3
  Bottom 0.254: J1.CSID3 84.18,15.3 81.5,15.3 80.15,16.65 66.05,16.65 64.6,18.1 64.6,23.1 64.05,23.65 62.65,23.65 62.31,23.31 SDIO.2
SELECT  (via drill 0.3)
  Top 0.254: R_B.7 88.75,58.8 85.35,62.2 v85.35,62.63
  Bottom 0.254: v85.35,62.63 84.95,62.23 IC3.15
SQUARE  (via drill 0.3)
  Top 0.254: R_B.18 94.25,56.5 92.2,58.55 90.42,58.55 88.1,60.87 v88.1,61.2
  Bottom 0.254: v88.1,61.2 88.08,60.92 IC3.17
START  (via drill 0.3)
  Top 0.254: v89.5,57.67 89.25,57.42 R_B.8
  Bottom 0.254: IC3.20 88.2,58.98 v89.5,57.67
TRIANGE  (via drill 0.3)
  Top 0.254: R_B.19 94.75,57 v93.78,57.98
  Bottom 0.254: IC3.18 89.08,60.27 90.65,58.7 93.05,58.7 v93.78,57.98
UP  (via drill 0.3)
  Top 0.254: L_B.4 18.7,56.65 v19.25,57.2
  Bottom 0.254: IC3.6 41.98,59.62 40.15,57.8 19.85,57.8 v19.25,57.2
VBAT_EXT  (via drill 0.3)
  Top 0.254: BAT.1 74.34,58.43 72.18,56.28 72.18,52.65 v72.08,52.54 | v67.85,50.97 66.55,49.67 v66.55,48.3
  Bottom 0.254: J1.BAT 64.5,48.3 v66.55,48.3 | v67.85,50.97 68.39,51.5 70.62,51.5 71.66,52.54 v72.08,52.54
VCC3V3  (via drill 0.3)
  Top 0.254: 31.55,49.25 31.05,48.75 DISP_DATA.3 | 31.55,49.25 33.25,50.95 | 33.25,50.95 v39.15,50.95 | v35.75,11.95 26.6,11.95 | 26.6,11.95 26.15,12.4 v26.15,14.25 v26.15,17 v26.15,18 v26.15,24.89 26.15,35.5 | 26.15,35.5 26.15,46.9 | 26.15,46.9 26.15,48.45 28.65,50.95 33.25,50.95 | 26.15,35.5 v26.7,35.5 29.67,32.53 v31.8,32.53 | v51.8,20.6 51.8,37.15 54.73,40.08 54.73,46.84 C9.1 57.04,49.16 57.04,49.75 57.16,49.87 v57.16,50.62 | v71.2,53.55 71.2,51.25 v70.65,50.7 | v60,19.3 v58.15,19.3 | v14.07,24.89 20.25,24.89 v20.26,24.88 | v96.44,56.44 96.25,56.25 R_B.22 | v25.6,46.9 26.15,46.9 | v10.15,11.95 26.6,11.95 | DISP_DATA.4 31.55,49.25 | v8.4,17.2 7.6,18 P_IN.P$1
  Bottom 0.254: IC2.5 34.86,12.84 v35.75,11.95 | IC2.11 26.29,14.11 v26.15,14.25 | IC2.13 26.5,16.65 v26.15,17 | IC2.14 26.23,17.92 v26.15,18 25.75,18.4 20.4,18.4 20.2,18.2 20.2,17.95 20.76,17.39 IC1.5 | R12.2 v26.7,35.5 | 16.2,52.95 16.2,51.5 16.45,51.25 24.15,51.25 24.45,50.95 v39.15,50.95 41.85,50.95 42.05,50.75 42.55,50.75 J1.VCC3V3@2 43.73,49.75 56.29,49.75 | 69.7,54.5 69.95,54.5 C16.2 | C16.2 69.89,54.9 IC3.24 | R28.2 70.5,52.85 v71.2,53.55 | v70.65,50.7 69.7,49.75 56.29,49.75 | v71.2,53.55 69.85,54.9 C16.2 | v71.2,53.55 72.15,54.5 94.5,54.5 v96.44,56.44 | v58.15,19.3 53.1,19.3 v51.8,20.6 | C1.1 25.9,14 v26.15,14.25 | IC2.9 26.98,11.57 26.15,12.4 v26.15,14.25 | U$27.6 v14.07,24.89 | v20.26,24.88 v26.15,24.88 v26.15,24.89 | v57.16,50.62 56.29,49.75 | R9.1 27,46.5 27.2,46.7 | 27.2,46.7 29.8,46.7 30,46.5 R2.1 | 27.2,46.7 25.8,46.7 v25.6,46.9 | IC4.3 C17.1 31.79,32.39 v31.8,32.53 | SDIO.4 60.11,19.41 v60,19.3 | v10.15,11.95 8.4,13.7 v8.4,17.2
VCC3V3_2
  Bottom 0.254: J1.VCC3V3@1 74.24,45.76 SJ3.1
VCC5V  (via drill 0.3)
  Top 0.254: 47.55,50.05 C10.1 47.25,50.05 | 47.24,52.11 C7.1 47.12,52.1 | 47.25,50.05 47.25,49 47.17,48.92 | 47.25,50.05 47.25,51.98 47.12,52.1 | 47.12,52.1 v50.95,52.1 | v59.15,52.05 v59.15,43.15 | DISP_DATA.35 47.05,48.8 47.17,48.92 | DISP_DATA.36 47.55,48.55 47.17,48.92
  Top 0.406: v81.5,55.3 77.55,51.35 73.95,51.35 v73.8,51.2 | v15.6,11 52.05,11 52.9,11.85 52.9,36.45 55.7,39.25 v55.7,43.15
  Bottom 0.254: J1.VCC-5V@2 84.16,55.96 82.16,55.96 v81.5,55.3 | v50.95,52.1 59.1,52.1 v59.15,52.05
  Bottom 0.406: v55.7,43.15 v59.15,43.15 67.3,43.15 69.95,45.8 SJ3.3 71.15,48.55 v73.8,51.2
  Bottom 0.813: L2.P$2 13.73,32.28 12.68,31.23 12.72,25.41 12.72,20.8 | 12.72,20.8 12.72,18.3 | 12.72,18.3 12.72,13.88 v15.6,11 | C4.1 13,20.52 12.72,20.8 | C2.1 12.74,18.32 12.72,18.3
VOL+  (via drill 0.3)
  Top 0.254: R_B.4 87.25,58.3 81.75,63.8 62.2,63.8 61.85,64.15 60.8,64.15 v60.05,63.4 59.95,63.5
  Bottom 0.254: v60.05,63.4 60.1,62.05 60.58,61.58 IC3.9
VOL-  (via drill 0.3)
  Top 0.254: R_B.3 86.75,58.15 81.6,63.3 v61.3,63.3
  Bottom 0.254: v61.3,63.3 61.3,62.55 61.6,62.25 65.51,62.25 IC3.10
VOUT  (via drill 0.3)
  Top 0.406: v51.65,12.95 50,14.6 50,36.92 53.16,40.08 53.16,55.69 v52.9,55.95 | v73.7,10.8 84.5,10.8 87.4,13.7 87.4,15.8 88.6,17 93.4,17 POWERIN.1 95.45,19.35
  Bottom 0.254: 52.87,55.92 v52.9,55.95
  Bottom 0.406: J1.CHG-IN 52.87,55.92 | v51.65,12.95 60.05,12.95 62.1,10.9 73.6,10.9 v73.7,10.8
VREG_OUTPUT
  Bottom 0.61: U$27.1 18.96,24.89 19.42,25.35 19.38,31.55 L2.P$1
  Bottom 1.27: L2.P$1 18.65,37.5 D2.A
VSYNC
  Bottom 0.254: J1.LCD-VSYNC 39.55,10.2 38.25,8.9 38.24,8.9 37.85,8.51 32.64,8.51 31.75,9.4 31.75,14.6 32.5,15.35 33.83,15.35 IC2.3
X  (via drill 0.3)
  Top 0.254: R_B.17 93.75,56.2 92.1,57.85 90.35,57.85 86.9,61.3 v86.9,61.8
  Bottom 0.254: v86.9,61.8 86.67,61.58 IC3.16

### Text on the board
tPlace: DESIGNED BY JKW | ENHANCED BY / ALLEYBEACHELECTRIC
tNames: 1 | 40